# EAGLE design BiodataModular_007 (EAGLE 9.6.2)
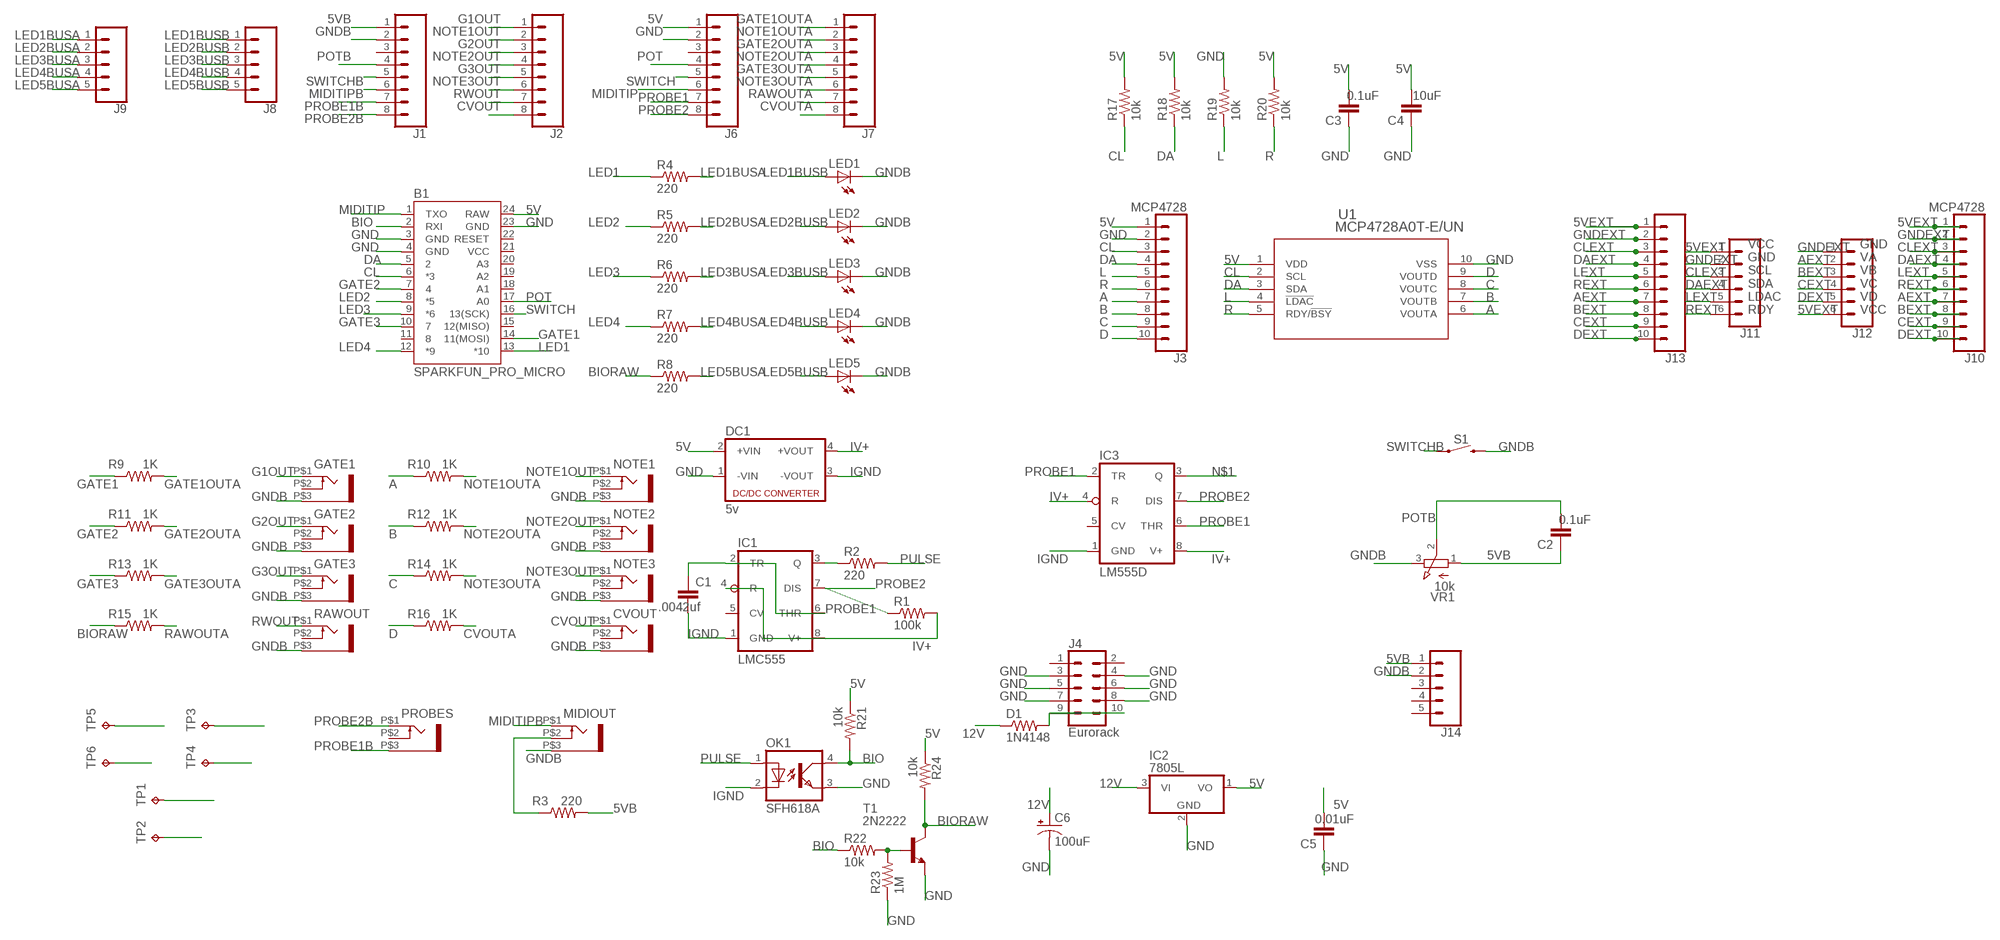
[diagram p0: schematic, sheet 1]

## Parts
B1  SPARKFUN_PRO_MICRO  [SPARKFUN_PRO_MICRO]
C1  .0042uf  C2.5/2  [C2.5-2]
C2  0.1uF  C2.5/2  [C2.5-2]
C3  0.1uF  C2.5/2  [C2.5-2]
C4  10uF  C2.5/2  [C2.5-2]
C5  0.01uF  C2.5/2  [C2.5-2]
C6  100uF  CPOL-USB45181A  [B45181A]
CVOUT  WQP-PJ301M-12_JACK  [WQP-PJ301M-12_JACK]
D1  1N4148  R-US_0204/2V  [0204V]
DC1  5v  NME  [NME]
GATE1  WQP-PJ301M-12_JACK  [WQP-PJ301M-12_JACK]
GATE2  WQP-PJ301M-12_JACK  [WQP-PJ301M-12_JACK]
GATE3  WQP-PJ301M-12_JACK  [WQP-PJ301M-12_JACK]
IC1  LMC555  LM555N  [DIL08]
IC2  7805L  [TO92]
IC3  LM555D  [SO08]
J1  CONN_08"  [1X08]
J2  CONN_08"  [1X08]
J3  MCP4728  CONN_10"  [1X10]
J4  Eurorack  CONN_05X2PTH  [2X5]
J6  CONN_08"  [1X08]
J7  CONN_08"  [1X08]
J8  CONN_05  [1X05]
J9  CONN_05  [1X05]
J10  MCP4728  CONN_10"  [1X10]
J11  CONN_06SILK_FEMALE_PTH  [1X06]
J12  CONN_06SILK_FEMALE_PTH  [1X06]
J13  CONN_10SMD_MALE  [1X10_SMD_MALE]
J14  CONN_05  [1X05]
LED1  LED3MM  [LED3MM]
LED2  LED3MM  [LED3MM]
LED3  LED3MM  [LED3MM]
LED4  LED3MM  [LED3MM]
LED5  LED3MM  [LED3MM]
MIDIOUT  WQP-PJ301M-12_JACK  [WQP-PJ301M-12_JACK]
NOTE1  WQP-PJ301M-12_JACK  [WQP-PJ301M-12_JACK]
NOTE2  WQP-PJ301M-12_JACK  [WQP-PJ301M-12_JACK]
NOTE3  WQP-PJ301M-12_JACK  [WQP-PJ301M-12_JACK]
OK1  SFH618A  SFH618A-5  [DIP4]
PROBES  WQP-PJ301M-12_JACK  [WQP-PJ301M-12_JACK]
R1  100k  R-US_0204/2V  [0204V]
R2  220  R-US_0204/2V  [0204V]
R3  220  R-US_0204/2V  [0204V]
R4  220  R-US_0204/2V  [0204V]
R5  220  R-US_0204/2V  [0204V]
R6  220  R-US_0204/2V  [0204V]
R7  220  R-US_0204/2V  [0204V]
R8  220  R-US_0204/2V  [0204V]
R9  1K  R-US_0204/2V  [0204V]
R10  1K  R-US_0204/2V  [0204V]
R11  1K  R-US_0204/2V  [0204V]
R12  1K  R-US_0204/2V  [0204V]
R13  1K  R-US_0204/2V  [0204V]
R14  1K  R-US_0204/2V  [0204V]
R15  1K  R-US_0204/2V  [0204V]
R16  1K  R-US_0204/2V  [0204V]
R17  10k  R-US_0204/2V  [0204V]
R18  10k  R-US_0204/2V  [0204V]
R19  10k  R-US_0204/2V  [0204V]
R20  10k  R-US_0204/2V  [0204V]
R21  10k  R-US_0204/2V  [0204V]
R22  10k  R-US_0204/2V  [0204V]
R23  1M  R-US_0204/2V  [0204V]
R24  10k  R-US_0204/2V  [0204V]
RAWOUT  WQP-PJ301M-12_JACK  [WQP-PJ301M-12_JACK]
S1  MOMENTARY-SWITCH-SPST-PTH-6.0MM  [TACTILE_SWITCH_PTH_6.0MM]
T1  2N2222  [TO92-EBC-OVAL]
TP1  TPB1,27  [B1,27]
TP2  TPB1,27  [B1,27]
TP3  TPB1,27  [B1,27]
TP4  TPB1,27  [B1,27]
TP5  TPB1,27  [B1,27]
TP6  TPB1,27  [B1,27]
U1  MCP4728A0T-E/UN  [MSOP10_MC]
VR1  10k  EVUF2A  [EVUF]

## Nets
5V: B1.24(RAW) C3.2 C4.2 C5.2 DC1.2(+VIN) IC2.1(VO) J3.1 J6.1 R17.2 R18.2 R20.2 R21.1 R24.1 U1.1(VDD)
5VB: C2.1 J1.1 J14.1 R3.2 VR1.1(A)
5VEXT: J10.1 J11.1 J12.6 J13.1
12V: C6.+ D1.1 IC2.3(VI)
A: J3.7 R10.1 U1.6(VOUTA)
AEXT: J10.7 J12.2 J13.7
B: J3.8 R12.1 U1.7(VOUTB)
BEXT: J10.8 J12.3 J13.8
BIO: B1.2(RXI) OK1.4(COL) R21.2 R22.1
BIORAW: R8.1 R15.1 R24.2 T1.C
C: J3.9 R14.1 U1.8(VOUTC)
CEXT: J10.9 J12.4 J13.9
CL: B1.6(*3) J3.3 R17.1 U1.2(SCL)
CLEXT: J10.3 J11.3 J13.3
CVOUT: CVOUT.P$1 J2.8
CVOUTA: J7.8 R16.2
D: J3.10 R16.1 U1.9(VOUTD)
DA: B1.5 J3.4 R18.1 U1.3(SDA)
DAEXT: J10.4 J11.4 J13.4
DEXT: J10.10 J12.5 J13.10
G1OUT: GATE1.P$1 J2.1
G2OUT: GATE2.P$1 J2.3
G3OUT: GATE3.P$1 J2.5
GATE1: B1.14(11(MOSI)) R9.1
GATE1OUTA: J7.1 R9.2
GATE2: B1.7 R11.1
GATE2OUTA: J7.3 R11.2
GATE3: B1.10 R13.1
GATE3OUTA: J7.5 R13.2
GND: B1.3(GND) B1.4(GND) B1.23(GND) C3.1 C4.1 C5.1 C6.- DC1.1(-VIN) IC2.2(GND) J3.2 J4.3 J4.4 J4.5 J4.6 J4.7 J4.8 J6.2 OK1.3(EMIT) R19.2 R23.1 T1.E U1.10(VSS)
GNDB: CVOUT.P$3 GATE1.P$3 GATE2.P$3 GATE3.P$3 J1.2 J14.2 LED1.K(C) LED2.K(C) LED3.K(C) LED4.K(C) LED5.K(C) MIDIOUT.P$3 NOTE1.P$3 NOTE2.P$3 NOTE3.P$3 RAWOUT.P$3 S1.3 VR1.3(E)
GNDEXT: J10.2 J11.2 J12.1 J13.2
IGND: C1.2 DC1.3(-VOUT) IC1.1(GND) IC3.1(GND) OK1.2(C)
IV+: DC1.4(+VOUT) IC1.4(R) IC1.8(V+) IC3.4(R) IC3.8(V+) R1.2
L: J3.5 R19.1 U1.4(!LDAC)
LED1: B1.13(*10) R4.1
LED1BUSA: J9.1 R4.2
LED1BUSB: J8.1 LED1.A
LED2: B1.8(*5) R5.1
LED2BUSA: J9.2 R5.2
LED2BUSB: J8.2 LED2.A
LED3: B1.9(*6) R6.1
LED3BUSA: J9.3 R6.2
LED3BUSB: J8.3 LED3.A
LED4: B1.12(*9) R7.1
LED4BUSA: J9.4 R7.2
LED4BUSB: J8.4 LED4.A
LED5BUSA: J9.5 R8.2
LED5BUSB: J8.5 LED5.A
LEXT: J10.5 J11.5 J13.5
MIDITIP: B1.1(TXO) J6.6
MIDITIPB: J1.6 MIDIOUT.P$1
N$1: IC1.3(Q) IC3.3(Q) R2.1
N$2: MIDIOUT.P$2 R3.1
N$7: D1.2 J4.9 J4.10
N$8: R22.2 R23.2 T1.B
NOTE1OUT: J2.2 NOTE1.P$1
NOTE1OUTA: J7.2 R10.2
NOTE2OUT: J2.4 NOTE2.P$1
NOTE2OUTA: J7.4 R12.2
NOTE3OUT: J2.6 NOTE3.P$1
NOTE3OUTA: J7.6 R14.2
POT: B1.17(A0) J6.4
POTB: C2.2 J1.4 VR1.2(S)
PROBE1: C1.1 IC1.2(TR) IC1.6(THR) IC3.2(TR) IC3.6(THR) J6.7
PROBE1B: J1.7 PROBES.P$3 TP2.TP
PROBE1C: TP4.TP
PROBE1C1: TP6.TP
PROBE2: IC1.7(DIS) IC3.7(DIS) J6.8 R1.1
PROBE2B: J1.8 PROBES.P$1 TP1.TP
PROBE2C: TP3.TP
PROBE2C1: TP5.TP
PULSE: OK1.1(A) R2.2
R: J3.6 R20.1 U1.5(RDY/!BSY)
RAWOUTA: J7.7 R15.2
REXT: J10.6 J11.6 J13.6
RWOUT: J2.7 RAWOUT.P$1
SWITCH: B1.16(13(SCK)) J6.5
SWITCHB: J1.5 S1.1
Unconnected: B1.11 B1.15(12(MISO)) B1.18(A1) B1.19(A2) B1.20(A3) B1.22(RESET) CVOUT.P$2 GATE1.P$2 GATE2.P$2 GATE3.P$2 IC1.5(CV) IC3.5(CV) J1.3 J4.1 J4.2 J6.3 J14.3 J14.4 J14.5 NOTE1.P$2 NOTE2.P$2 NOTE3.P$2 PROBES.P$2 RAWOUT.P$2

## Notes on the sheet
- VCC
  GND
  SCL
  SDA
  LDAC
  RDY
- GND
  VA
  VB
  VC
  VD
  VCC

## Power pins joined to a net without a drawn wire
VCC: B1.21(VCC)

## Library data of the parts
B1 = SparkFun-Boards:SPARKFUN_PRO_MICRO: SparkFun Pro Micro Atmega32U4 compatible footprint. SparkFun Products: 3.3V/8MHz <https://www.sparkfun.com/products/12587> 5V/16MHz <https://www.sparkfun.com/products/12640>
C1-C5 = capacitor-wima:C: CAPACITOR naming: grid - package width
C6 = adafruit:CPOL-US: POLARIZED CAPACITOR, American symbol
CVOUT GATE1-GATE3 MIDIOUT NOTE1-NOTE3 PROBES RAWOUT = thonkiconn:WQP-PJ301M-12_JACK
D1 R1-R24 = rcl:R-US_: RESISTOR, American symbol
DC1 = dc-dc-converter:NME: DC-DC CONVERTER; MF: C & D TECHNOLOGIES, INC; MPN: NME1205D; OC_FARNELL: 1021466; OC_NEWARK: 98B8198
IC1 = linear:*555: TIMER Changed DIP package to have round (not oval) pin pads http://www.ladyada.net/library/pcb/eaglelibrary.html
IC2 = adafruit:78*: Positive VOLTAGE REGULATOR Added bigger pads to the TO-92 package
IC3 = adafruit:*555: TIMER Changed DIP package to have round (not oval) pin pads http://www.ladyada.net/library/pcb/eaglelibrary.html
J1 J2 J6 J7 = SparkFun-Connectors:CONN_08: Multi connection point. Often used as Generic Header-pin footprint for 0.1 inch spaced/style header connections On any of the 0.1 inch spaced packages, you can populate with these: Break Away Headers - Straight <https://www.sparkfun.com/products/116> (PRT-00116) Break Away Male Headers - Right Angle <https://www.sparkfun.com/products/553> (PRT-00553) Female Headers <https://www.sparkfun.com/products/115> (PRT-00115) Break Away Headers - Machine Pin <https://www.sparkfun.com/products/117> (PRT-00117) Break Away Female Headers - Swiss Machine Pin <https://www.sparkfun.com/products/743> (PRT-00743) Arduino Stackable Header - 8 Pin <https://www.sparkfun.com/products/9279> (PRT-09279) For SCREWTERMINALS and SPRING TERMINALS visit here: Screw Terimnals on SparkFun.com <https://www.sparkfun.com/search/results?term=Screw+Terminals> (5mm/3.5mm/2.54mm spacing) This device is also useful as a general connection point to wire up your design to another part of your project. Our various solder wires solder well into these plated through hole pads. Hook-Up Wire - Assortment (Stranded, 22 AWG) <https://www.sparkfun.com/products/11375> (PRT-11375) Hook-Up Wire - Assortment (Solid Core, 22 AWG) <https://www.sparkfun.com/products/11367> (PRT-11367) View the entire wire category on our website here <https://www.sparkfun.com/categories/141> Special notes: Molex polarized connector foot print use with SKU : PRT-08231 with associated crimp pins and housings. 1MM SMD Version SKU: PRT-10208 NOTES ON THE VARIANTS LOCK and LOCK_LONGPADS... This footprint was designed to help hold the alignment of a through-hole component (i.e. 6-pin header) while soldering it into place. You may notice that each hole has been shifted either up or down by 0.005 of an inch from it's more standard position (which is a perfectly straight line). This slight alteration caused the pins (the squares in the middle) to touch the edges of the holes. Because they are alternating, it causes a "brace" to hold the component in place. 0.005 has proven to be the perfect amount of "off-center" position when using our standard breakaway headers. Although looks a little odd when you look at the bare footprint, once you have a header in there, the alteration is very hard to notice. Also,if you push a header all the way into place, it is covered up entirely on the bottom side.; PROD_ID: CONN-08438
J3 J10 = SparkFun-Connectors:CONN_10: Multi connection point. Often used as Generic Header-pin footprint for 0.1 inch spaced/style header connections On any of the 0.1 inch spaced packages, you can populate with these: Break Away Headers - Straight <https://www.sparkfun.com/products/116> (PRT-00116) Break Away Male Headers - Right Angle <https://www.sparkfun.com/products/553> (PRT-00553) Female Headers <https://www.sparkfun.com/products/115> (PRT-00115) Break Away Headers - Machine Pin <https://www.sparkfun.com/products/117> (PRT-00117) Break Away Female Headers - Swiss Machine Pin <https://www.sparkfun.com/products/743> (PRT-00743) Arduino Stackable Header - 10 Pin <https://www.sparkfun.com/products/11376> (PRT-11376) For SCREWTERMINALS and SPRING TERMINALS visit here: Screw Terimnals on SparkFun.com <https://www.sparkfun.com/search/results?term=Screw+Terminals> (5mm/3.5mm/2.54mm spacing) This device is also useful as a general connection point to wire up your design to another part of your project. Our various solder wires solder well into these plated through hole pads. Hook-Up Wire - Assortment (Stranded, 22 AWG) <https://www.sparkfun.com/products/11375> (PRT-11375) Hook-Up Wire - Assortment (Solid Core, 22 AWG) <https://www.sparkfun.com/products/11367> (PRT-11367) View the entire wire category on our website here <https://www.sparkfun.com/categories/141> Special notes: Molex polarized connector foot print use with SKU : PRT-08231 with associated crimp pins and housings. 1MM SMD Version SKU: PRT-10208 NOTES ON THE VARIANTS LOCK and LOCK_LONGPADS... This footprint was designed to help hold the alignment of a through-hole component (i.e. 6-pin header) while soldering it into place. You may notice that each hole has been shifted either up or down by 0.005 of an inch from it's more standard position (which is a perfectly straight line). This slight alteration caused the pins (the squares in the middle) to touch the edges of the holes. Because they are alternating, it causes a "brace" to hold the component in place. 0.005 has proven to be the perfect amount of "off-center" position when using our standard breakaway headers. Although looks a little odd when you look at the bare footprint, once you have a header in there, the alteration is very hard to notice. Also,if you push a header all the way into place, it is covered up entirely on the bottom side.; PROD_ID: CONN-11563
J4 = SparkFun-Connectors:CONN_05X2: Multi connection point. Often used as Generic Header-pin footprint for 0.1 inch spaced/style header connections For AVR SPI programming port, see special device with nice symbol: "AVR_SPI_PROG_5x2.dev" You can populate with any combo of single row headers, but if you'd like an exact match, check these: 2x5 AVR ICSP Male Header <https://www.sparkfun.com/products/778> (PRT-00778) 2x5 Pin Shrouded Header <https://www.sparkfun.com/products/8506> (PRT-08506) On any of the 0.1 inch spaced packages, you can populate with these: Break Away Headers - Straight <https://www.sparkfun.com/products/116> (PRT-00116) Break Away Male Headers - Right Angle <https://www.sparkfun.com/products/553> (PRT-00553) Female Headers <https://www.sparkfun.com/products/115> (PRT-00115) Break Away Headers - Machine Pin <https://www.sparkfun.com/products/117> (PRT-00117) Break Away Female Headers - Swiss Machine Pin <https://www.sparkfun.com/products/743> (PRT-00743) Special note: the shrouded connector mates well with our 5x2 ribbon cables: 2x5 Pin IDC Ribbon Cable <https://www.sparkfun.com/products/8535> (PRT-08535); PROD_ID: CONN-08499; SF_ID: PRT-0778
J8 J9 J14 = SparkFun-Connectors:CONN_05: Multi connection point. Often used as Generic Header-pin footprint for 0.1 inch spaced/style header connections On any of the 0.1 inch spaced packages, you can populate with these: Break Away Headers - Straight <https://www.sparkfun.com/products/116> (PRT-00116) Break Away Male Headers - Right Angle <https://www.sparkfun.com/products/553> (PRT-00553) Female Headers <https://www.sparkfun.com/products/115> (PRT-00115) Break Away Headers - Machine Pin <https://www.sparkfun.com/products/117> (PRT-00117) Break Away Female Headers - Swiss Machine Pin <https://www.sparkfun.com/products/743> (PRT-00743) For SCREWTERMINALS and SPRING TERMINALS visit here: Screw Terimnals on SparkFun.com <https://www.sparkfun.com/search/results?term=Screw+Terminals> (5mm/3.5mm/2.54mm spacing) This device is also useful as a general connection point to wire up your design to another part of your project. Our various solder wires solder well into these plated through hole pads. Hook-Up Wire - Assortment (Stranded, 22 AWG) <https://www.sparkfun.com/products/11375> (PRT-11375) Hook-Up Wire - Assortment (Solid Core, 22 AWG) <https://www.sparkfun.com/products/11367> (PRT-11367) View the entire wire category on our website here <https://www.sparkfun.com/categories/141> Special notes: Molex polarized connector foot print use with SKU : PRT-08231 with associated crimp pins and housings. 1MM SMD Version SKU: PRT-10208
J11 J12 = SparkFun-Connectors:CONN_06: Multi connection point. Often used as Generic Header-pin footprint for 0.1 inch spaced/style header connections On any of the 0.1 inch spaced packages, you can populate with these: Break Away Headers - Straight <https://www.sparkfun.com/products/116> (PRT-00116) Break Away Male Headers - Right Angle <https://www.sparkfun.com/products/553> (PRT-00553) Female Headers <https://www.sparkfun.com/products/115> (PRT-00115) Break Away Headers - Machine Pin <https://www.sparkfun.com/products/117> (PRT-00117) Break Away Female Headers - Swiss Machine Pin <https://www.sparkfun.com/products/743> (PRT-00743) Arduino Stackable Header - 6 Pin <https://www.sparkfun.com/products/9280> (PRT-09280) For SCREWTERMINALS and SPRING TERMINALS visit here: Screw Terimnals on SparkFun.com <https://www.sparkfun.com/search/results?term=Screw+Terminals> (5mm/3.5mm/2.54mm spacing) This device is also useful as a general connection point to wire up your design to another part of your project. Our various solder wires solder well into these plated through hole pads. Hook-Up Wire - Assortment (Stranded, 22 AWG) <https://www.sparkfun.com/products/11375> (PRT-11375) Hook-Up Wire - Assortment (Solid Core, 22 AWG) <https://www.sparkfun.com/products/11367> (PRT-11367) View the entire wire category on our website here <https://www.sparkfun.com/categories/141>; PROD_ID: CONN-08437
J13 = SparkFun-Connectors:CONN_10: Multi connection point. Often used as Generic Header-pin footprint for 0.1 inch spaced/style header connections On any of the 0.1 inch spaced packages, you can populate with these: Break Away Headers - Straight <https://www.sparkfun.com/products/116> (PRT-00116) Break Away Male Headers - Right Angle <https://www.sparkfun.com/products/553> (PRT-00553) Female Headers <https://www.sparkfun.com/products/115> (PRT-00115) Break Away Headers - Machine Pin <https://www.sparkfun.com/products/117> (PRT-00117) Break Away Female Headers - Swiss Machine Pin <https://www.sparkfun.com/products/743> (PRT-00743) Arduino Stackable Header - 10 Pin <https://www.sparkfun.com/products/11376> (PRT-11376) For SCREWTERMINALS and SPRING TERMINALS visit here: Screw Terimnals on SparkFun.com <https://www.sparkfun.com/search/results?term=Screw+Terminals> (5mm/3.5mm/2.54mm spacing) This device is also useful as a general connection point to wire up your design to another part of your project. Our various solder wires solder well into these plated through hole pads. Hook-Up Wire - Assortment (Stranded, 22 AWG) <https://www.sparkfun.com/products/11375> (PRT-11375) Hook-Up Wire - Assortment (Solid Core, 22 AWG) <https://www.sparkfun.com/products/11367> (PRT-11367) View the entire wire category on our website here <https://www.sparkfun.com/categories/141> Special notes: Molex polarized connector foot print use with SKU : PRT-08231 with associated crimp pins and housings. 1MM SMD Version SKU: PRT-10208 NOTES ON THE VARIANTS LOCK and LOCK_LONGPADS... This footprint was designed to help hold the alignment of a through-hole component (i.e. 6-pin header) while soldering it into place. You may notice that each hole has been shifted either up or down by 0.005 of an inch from it's more standard position (which is a perfectly straight line). This slight alteration caused the pins (the squares in the middle) to touch the edges of the holes. Because they are alternating, it causes a "brace" to hold the component in place. 0.005 has proven to be the perfect amount of "off-center" position when using our standard breakaway headers. Although looks a little odd when you look at the bare footprint, once you have a header in there, the alteration is very hard to notice. Also,if you push a header all the way into place, it is covered up entirely on the bottom side.; PROD_ID: CONN-11291
LED1-LED5 = adafruit:LED: LED OSRAM: - CHIPLED LG R971, LG N971, LY N971, LG Q971, LY Q971, LO R971, LY R971 LH N974, LH R974 LS Q976, LO Q976, LY Q976 LO Q996 - Hyper CHIPLED LW Q18S LB Q993, LB Q99A, LB R99A - SideLED LS A670, LO A670, LY A670, LG A670, LP A670 LB A673, LV A673, LT A673, LW A673 LH A674 LY A675 LS A676, LA A676, LO A676, LY A676, LW A676 LS A679, LY A679, LG A679 - Hyper Micro SIDELED® LS Y876, LA Y876, LO Y876, LY Y876 LT Y87S - SmartLED LW L88C, LW L88S LB L89C, LB L89S, LG L890 LS L89K, LO L89K, LY L89K LS L896, LA L896, LO L896, LY L896 - TOPLED LS T670, LO T670, LY T670, LG T670, LP T670 LSG T670, LSP T670, LSY T670, LOP T670, LYG T670 LG T671, LOG T671, LSG T671 LB T673, LV T673, LT T673, LW T673 LH T674 LS T676, LA T676, LO T676, LY T676, LB T676, LH T676, LSB T676, LW T676 LB T67C, LV T67C, LT T67C, LS T67K, LO T67K, LY T67K, LW E67C LS E67B, LA E67B, LO E67B, LY E67B, LB E67C, LV E67C, LT E67C LW T67C LS T679, LY T679, LG T679 LS T770, LO T770, LY T770, LG T770, LP T770 LB T773, LV T773, LT T773, LW T773 LH T774 LS E675, LA E675, LY E675, LS T675 LS T776, LA T776, LO T776, LY T776, LB T776 LHGB T686 LT T68C, LB T68C - Hyper Mini TOPLED® LB M676 - Mini TOPLED Santana® LG M470 LS M47K, LO M47K, LY M47K Source: http://www.osram.convergy.de/
OK1 = optocoupler:SFH618?*: Optocoupler, Phototransistor Output, Low Input Current Source: Data sheet <http://www.vishay.com/docs/83673/sfh618.pdf>; MF: VISHAY/TELEFUNKEN; MPN: SFH618A-5; OC_FARNELL: 1469593; OC_NEWARK: 59K0259
S1 = SparkFun-Switches:MOMENTARY-SWITCH-SPST: Momentary Switch (Pushbutton) - SPST Normally-open (NO) SPST momentary switches (buttons, pushbuttons). Variants PTH-12MM - 12mm square, through-hole Momentary Pushbutton Switch - 12mm Square <https://www.sparkfun.com/products/9190> (COM-09190) PTH-6.0MM, PTH-6.0MM-KIT - 6.0mm square, through-hole Mini Pushbutton Switch <https://www.sparkfun.com/products/97> (COM-00097) KIT package intended for soldering kit's - only one side of pads' copper is exposed. PTH-RIGHT-ANGLE-KIT - Right-angle, through-hole Right Angle Tactile Button <https://www.sparkfun.com/products/10791> - Used on SparkFun BigTime Watch Kit <https://www.sparkfun.com/products/11734> SMD-12MM - 12mm square, surface-mount Tactile Button - SMD (12mm) <https://www.sparkfun.com/products/12993> (COM-12993) Used on SparkFun PicoBoard <https://www.sparkfun.com/products/11888> SMD-4.5MM - 4.5mm Square Trackball Switch Used on SparkFun Blackberry Trackballer Breakout <https://www.sparkfun.com/products/13169> SMD-4.6MMX2.8MM - 4.60mm x 2.80mm, surface mount Used on SparkFun SAMD21 Mini Breakout <https://www.sparkfun.com/products/13664> SMD-5.2MM, SMD-5.2-REDUNDANT - 5.2mm square, surface-mount Mini Pushbutton Switch - SMD <https://www.sparkfun.com/products/8720> (COM-08720) Used on Arduino Pro Mini <https://www.sparkfun.com/products/11114> REDUNDANT package connects both switch circuits together SMD-6.0X3.5MM - 6.0 x 3.5mm, surface mount Momentary Reset Switch SMD <https://www.sparkfun.com/products/8229> (COM-08229) SMD-6.2MM-TALL - 6.2mm square, surface mount Tactile Button - SMD (6mm) <https://www.sparkfun.com/products/12992> Used on SparkFun Digital Sandbox <https://www.sparkfun.com/products/12651> SMD-RIGHT-ANGLE - Right-angle, surface mount Used on SparkFun Block for Intel® Edison - Arduino <https://www.sparkfun.com/products/13036>; PROD_ID: SWCH-08441; SF_SKU: COM-00097
T1 = adafruit:2N2222: NPN TRANSISTOR Big oval pads
TP1-TP6 = testpad:TP: Test pad
U1 = MCP4728:MCP4728A0T-E/UN; MANUFACTURER_PART_NUMBER: MCP4728A0TEUN; VENDOR: Microchip
VR1 = sam-pot:EVU: 9 mm Square Rotary Potentiometers Source: Panasonic

## Board
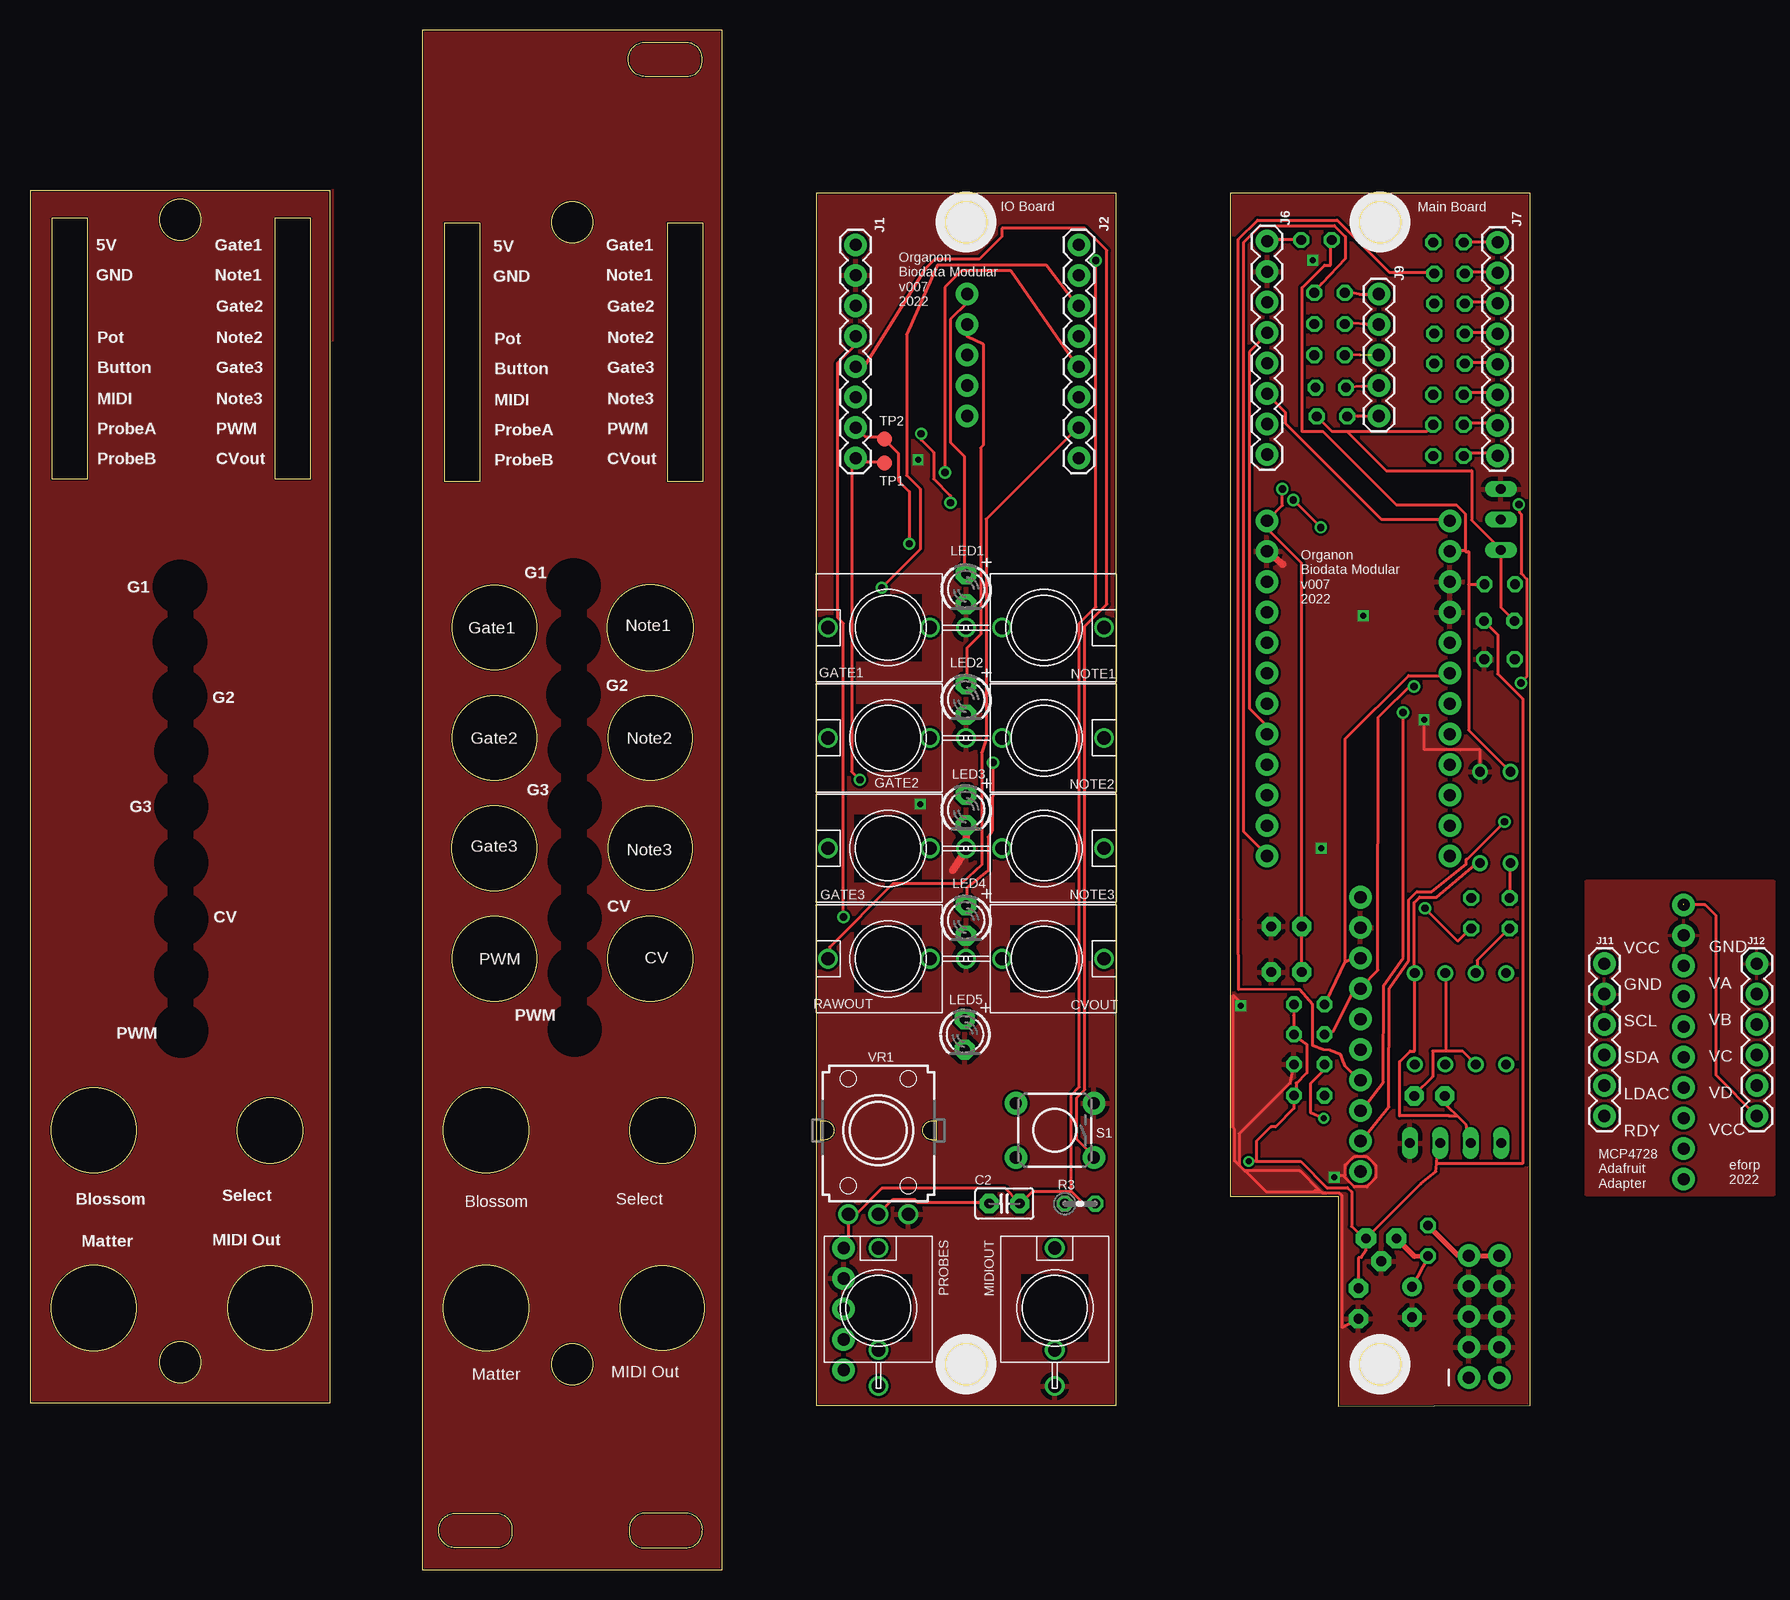
[diagram p1: board, top side]
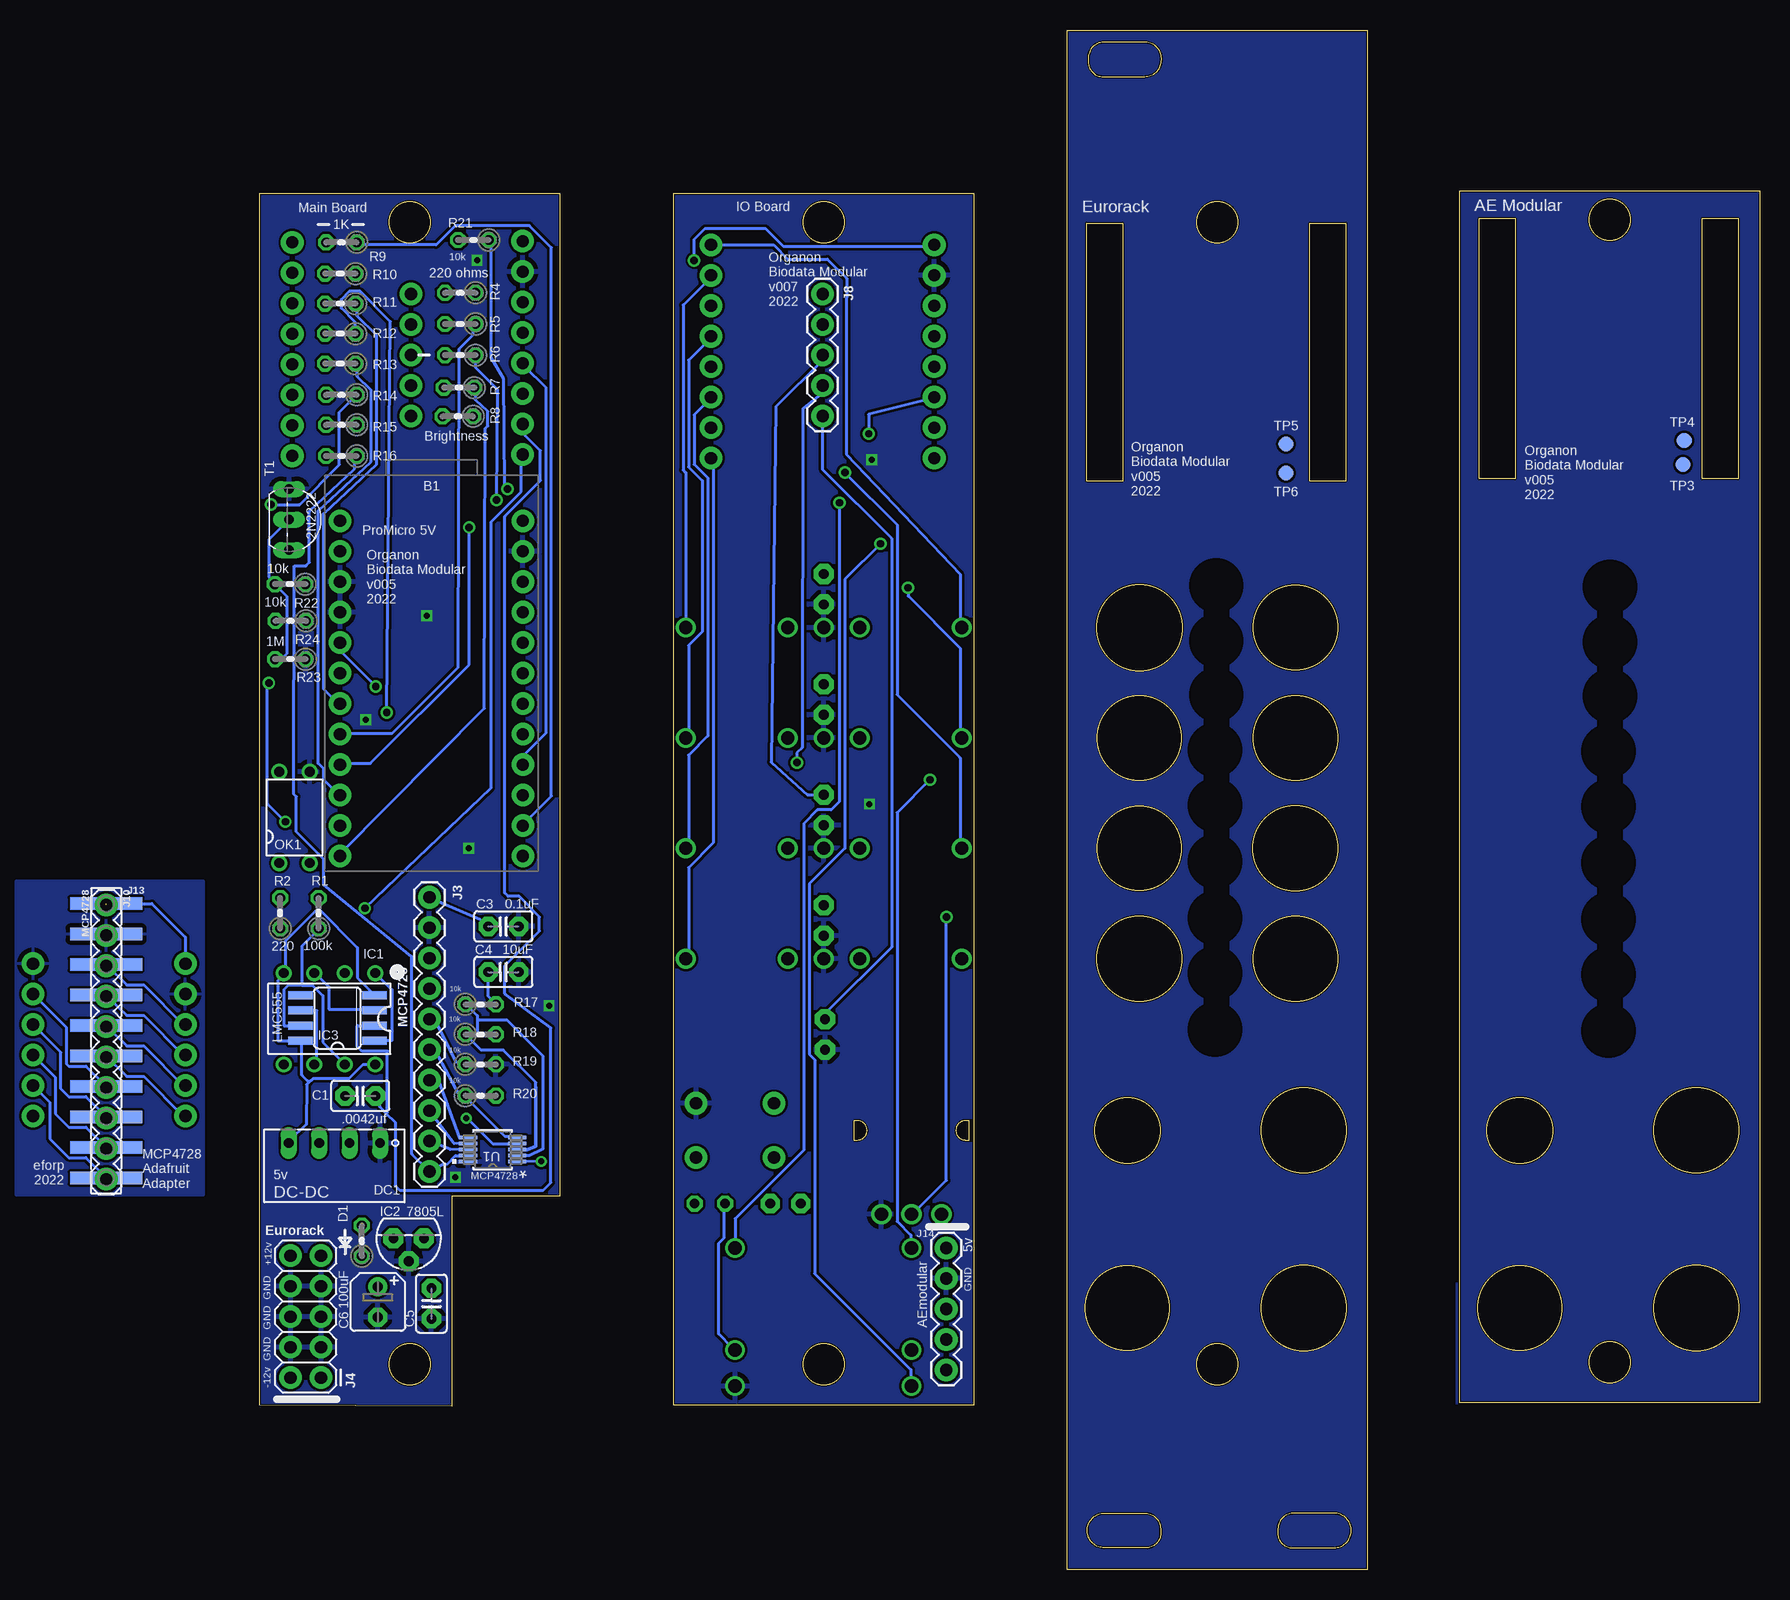
[diagram p2: board, bottom side, seen from below]

Size 125 x 128.3 mm. Coordinates in mm from the lower left corner, seen from the top.
Outline: 65.5,13.7 90.5,13.7 90.5,114.7 65.5,114.7 65.5,13.7
Outline: 125,13.7 125,114.7 100,114.7 100,31.1 109,31.1 109,13.6 125,13.7
Outline: 32.7,0 57.7,0 57.7,128.3 32.7,128.3 32.7,0
Outline: 0,13.9 25,13.9 25,114.9 0,114.9 0,13.9
Outline: 54.86,124.42 51.26,124.42 arc-90 49.86,125.82 arc-90 51.16,127.29 54.74,127.29 arc-90 55.96,125.9 55.96,125.72 arc-90 54.86,124.42
Outline: 39.06,1.82 35.46,1.82 arc-90 34.06,3.22 arc-90 35.36,4.69 38.94,4.69 arc-90 40.16,3.3 40.16,3.12 arc-90 39.06,1.82
Outline: 51.04,1.82 54.64,1.82 arc90 56.04,3.22 arc90 54.74,4.69 51.16,4.69 arc90 49.94,3.3 49.94,3.12 arc90 51.04,1.82
Outline: circle at 78,112.3 radius 1.7
Outline: circle at 78,17.1 radius 1.7
Outline: circle at 112.5,112.3 radius 1.7
Outline: circle at 112.5,17.1 radius 1.7
Outline: circle at 45.2,112.3 radius 1.7
Outline: circle at 45.2,17.1 radius 1.7
Outline: circle at 38.7,78.5 radius 3.52
Outline: circle at 51.7,78.5 radius 3.57
Outline: circle at 38.7,69.3 radius 3.51
Outline: circle at 51.7,69.3 radius 3.49
Outline: circle at 38.7,60.1 radius 3.54
Outline: circle at 51.7,60.1 radius 3.49
Outline: circle at 38.7,50.9 radius 3.52
Outline: circle at 51.7,50.9 radius 3.54
Outline: circle at 38,21.8 radius 3.54
Outline: circle at 52.7,21.8 radius 3.49
Outline: circle at 38,36.6 radius 3.54
Outline: circle at 52.7,36.6 radius 2.73
Outline: circle at 12.5,112.5 radius 1.7
Outline: circle at 12.5,17.3 radius 1.7
Copper layers (1*16): Top 0.035mm / dielectric 1.5mm / Bottom 0.035mm
Design rules "default *": minimum track width 10mil, minimum drill 24mil, track to track 8mil, track to pad 8mil, pad to pad 8mil, via to via 8mil, smd to smd 8mil, copper to edge 5mil, drill to drill 8mil, minimum pad ring 10mil, minimum via ring 8mil, stop-mask expansion 4mil, vias tented up to drill 0mil, thermal gap 15mil
tRestrict: area 12.1,81.5 to 12.9,82.3; area 12.1,72.4 to 12.9,73.2; area 12.1,76.9 to 12.9,77.7; area 12.2,63.2 to 13,64; area 12.2,67.8 to 13,68.6; area 12.2,53.8 to 13,54.6; area 12.2,58.5 to 13,59.3; area 12.2,44.5 to 13,45.3; area 12.2,49.2 to 13,50; area 44.9,81.6 to 45.7,82.4; area 44.9,72.5 to 45.7,73.3; area 44.9,77 to 45.7,77.8; 6 more areas; 2 lines
bRestrict: area 12.1,81.5 to 12.9,82.3; area 12.1,72.4 to 12.9,73.2; area 12.1,76.9 to 12.9,77.7; area 12.2,63.2 to 13,64; area 12.2,67.8 to 13,68.6; area 12.2,53.8 to 13,54.6; area 12.2,58.5 to 13,59.3; area 12.2,44.5 to 13,45.3; area 12.2,49.2 to 13,50; area 44.9,81.6 to 45.7,82.4; area 44.9,72.5 to 45.7,73.3; area 44.9,77 to 45.7,77.8; 6 more areas; 2 lines

### Footprints (pad centres in the part's own frame; a part is rotated, then mirrored left to right if it is on the bottom)
SPARKFUN_PRO_MICRO = drill 1.016 pad 1.88: 1 -7.62,12.7; 2 -7.62,10.16; 3 -7.62,7.62; 4 -7.62,5.08; 5 -7.62,2.54; 6 -7.62,0; 7 -7.62,-2.54; 8 -7.62,-5.08; 9 -7.62,-7.62; 10 -7.62,-10.16; 11 -7.62,-12.7; 12 -7.62,-15.24; 13 7.62,-15.24; 14 7.62,-12.7; 15 7.62,-10.16; 16 7.62,-7.62; 17 7.62,-5.08; 18 7.62,-2.54; 19 7.62,0; 20 7.62,2.54; 21 7.62,5.08; 22 7.62,7.62; 23 7.62,10.16; 24 7.62,12.7
C2.5-2 = drill 0.813 pad 1.6 octagon: 1 -1.27,0; 2 1.27,0
B45181A = drill 0.813 pad 1.6: + -1.27,0 | drill 0.813 pad 1.6 octagon: - 1.27,0
WQP-PJ301M-12_JACK = drill 1.1: P$1 0,5; P$2 0,-3.5; P$3 0,-6.5
0204V = drill 0.813 octagon: 1 -1.27,0; 2 1.27,0
NME = drill 0.813 long: 1 0,3.81; 2 0,1.27; 3 0,-1.27; 4 0,-3.81
DIL08 = drill 0.813 pad 1.27: 1 -3.81,-3.81; 2 -1.27,-3.81; 3 1.27,-3.81; 4 3.81,-3.81; 5 3.81,3.81; 6 1.27,3.81; 7 -1.27,3.81; 8 -3.81,3.81
TO92 = drill 0.813 pad 1.676 octagon: 1 -1.27,0; 2 0,1.905; 3 1.27,0
SO08 = smd 0.66 x 2.032: 1 -1.905,-3.073; 2 -0.635,-3.073; 3 0.635,-3.073; 4 1.905,-3.073; 5 1.905,3.073; 6 0.635,3.073; 7 -0.635,3.073; 8 -1.905,3.073
1X08 = drill 1.016 pad 1.88: 1 0,0; 2 2.54,0; 3 5.08,0; 4 7.62,0; 5 10.16,0; 6 12.7,0; 7 15.24,0; 8 17.78,0
1X10 = drill 1.016 pad 1.88: 1 0,0; 2 2.54,0; 3 5.08,0; 4 7.62,0; 5 10.16,0; 6 12.7,0; 7 15.24,0; 8 17.78,0; 9 20.32,0; 10 22.86,0
2X5 = drill 1.016 pad 1.88: 1 0,0; 2 0,2.54; 3 2.54,0; 4 2.54,2.54; 5 5.08,0; 6 5.08,2.54; 7 7.62,0; 8 7.62,2.54; 9 10.16,0; 10 10.16,2.54
1X05 = drill 1.016 pad 1.88: 1 0,0; 2 2.54,0; 3 5.08,0; 4 7.62,0; 5 10.16,0
1X06 = drill 1.016 pad 1.88: 1 0,0; 2 2.54,0; 3 5.08,0; 4 7.62,0; 5 10.16,0; 6 12.7,0
1X10_SMD_MALE = smd 1.02 x 6: 1 0,0; 2 2.54,0; 3 5.08,0; 4 7.62,0; 5 10.16,0; 6 12.7,0; 7 15.24,0; 8 17.78,0; 9 20.32,0; 10 22.86,0
LED3MM = drill 0.813 pad 1.676 octagon: A -1.27,0; K 1.27,0
DIP4 = drill 0.8: 1 -1.27,-3.81; 2 1.27,-3.81; 3 1.27,3.81; 4 -1.27,3.81
TACTILE_SWITCH_PTH_6.0MM = drill 1.016 pad 1.88: 1 -3.251,2.261; 2 3.251,2.261; 3 -3.251,-2.261; 4 3.251,-2.261
TO92-EBC-OVAL = drill 0.813 long: B 0,-1.27; C 2.54,-1.27; E -2.54,-1.27
B1,27 = smd 1.27 x 1.27: TP 0,0
MSOP10_MC = smd 1.524 x 0.279: 1 -2.045,1; 2 -2.045,0.5; 3 -2.045,0; 4 -2.045,-0.5; 5 -2.045,-1; 6 2.045,-1; 7 2.045,-0.5; 8 2.045,0; 9 2.045,0.5; 10 2.045,1
EVUF = drill 1.1 pad 1.676: 1 -2.5,-7; 2 0,-7; 3 2.5,-7

### Placement (x,y rotation side)
B1  110.7,74.7 0 bottom
C1  116.63,39.47 180 bottom
C2  81.2,30.5 180 top
C3  104.7,53.6 180 bottom
C4  104.7,49.8 180 bottom
C5  110.7,22.17 90 bottom
C6  115.17,22.3 270 bottom
CVOUT  84.5,50.9 270 top
D1  116.5,27.4 90 bottom
DC1  118.79,35.55 270 bottom
GATE1  71.5,78.5 90 top
GATE2  71.5,69.3 90 top
GATE3  71.5,60.1 90 top
IC1  119.2,45.9 180 bottom
IC2  112.6,27.6 180 bottom
IC3  118.53,45.96 90 bottom
J1  68.8,110.4 270 top
J2  87.4,110.4 270 top
J3  110.87,56.03 270 bottom
J4  119.9,16 90 bottom
J6  103.1,110.7 270 top
J7  122.3,110.6 270 top
J8  78.1,106.3 270 bottom
J9  112.4,106.3 270 top
J10  137.8,55.4 270 bottom  (outside the outline)
J11  131.2,50.5 270 top  (outside the outline)
J12  143.9,50.5 270 top  (outside the outline)
J13  137.8,55.5 270 bottom  (outside the outline)
J14  67.8,26.8 270 bottom
LED1  78,81.7 270 top
LED2  78,72.5 270 top
LED3  78,63.3 270 top
LED4  78,54.1 270 top
LED5  77.9,44.6 270 top
MIDIOUT  85.4,21.8 0 top
NOTE1  84.5,78.5 270 top
NOTE2  84.5,69.3 270 top
NOTE3  84.5,60.1 270 top
OK1  122.11,62.68 0 bottom
PROBES  70.7,21.8 0 top
R1  120.1,54.7 90 bottom
R2  123.3,54.7 90 bottom
R3  87.5,30.5 0 top
R4  108.3,106.4 180 bottom
R5  108.3,103.8 180 bottom
R6  108.3,101.2 180 bottom
R7  108.4,98.5 180 bottom
R8  108.5,96.1 180 bottom
R9  118.2,110.6 180 bottom
R10  118.3,108 180 bottom
R11  118.3,105.5 180 bottom
R12  118.3,103 180 bottom
R13  118.3,100.5 180 bottom
R14  118.2,97.9 180 bottom
R15  118.2,95.4 180 bottom
R16  118.2,92.8 180 bottom
R17  106.6,47.1 0 bottom
R18  106.6,44.6 0 bottom
R19  106.6,42.1 0 bottom
R20  106.6,39.5 0 bottom
R21  107.2,110.8 180 bottom
R22  122.48,82.12 180 bottom
R23  122.46,75.87 180 bottom
R24  122.43,79.06 180 bottom
RAWOUT  71.5,50.9 90 top
S1  85.4,36.6 180 top
T1  121.3,87.5 270 bottom
TP1  71.2,92.2 0 top
TP2  71.2,94.2 0 top
TP3  6.4,92.1 0 bottom
TP4  6.3,94.1 0 bottom
TP5  39.5,93.8 0 bottom
TP6  39.5,91.4 0 bottom
U1  105.6,35 180 bottom
VR1  70.7,36.6 0 top

### Tracks (layer width: path | path; a pad name or v marks a point on that pad's centre or on a via)
5V  (via drill 0.5, 0.61)
  Top 0.254: 117.22,33.83 117.16,33.17 115.9,32.14 111.66,27.89 IC2.1 111.33,27.4 | 117.22,33.83 117.26,34.45 117.46,34.64 DC1.2 | 111.33,27.4 110.13,28.6 110.13,31.47 109.77,31.83 108.07,31.83 105.89,34.01 102.2,34.01 | 111.33,27.4 111.33,26.58 110.95,26.01 110.7,25.98 C5.2 | R21.1 105.73,110.86 103.22,110.86 J6.1 | R17.2 105.31,46.48 105.31,46.19 R18.2 105.52,44.41 106.41,43.77 106.41,41.38 105.58,40.55 105.5,40.55 105.5,39.53 R20.2 105.33,38.43 103.8,36.9 103.4,36.9 102.2,35.7 102.2,34.01 | C4.2 105.96,49.82 105.96,53.48 C3.2 105.96,53.7 105.96,83.88 103.22,86.62 103.22,87.31 B1.24 103.22,87.54 104.36,88.68 v104.36,90.05 | 117.22,33.83 117.25,33.83 124.38,33.83 124.38,72.57 122.3,74.65 122.3,77.92 R24.1 | 101.4,34.01 v101.55,34.01 102.2,34.01
  Bottom 0.254: C4.2 105.96,49.59 105.96,47.76 105.5,47.3 R17.2 | J3.1 110.73,55.89 106.65,54.16 106.19,53.7 C3.2 | v104.36,90.05 104.59,90.28 104.69,99.23 105.73,100.97 105.73,110.63 R21.1 | v101.55,34.01 103.55,33.99 U1.1
5VB  (via drill 0.61)
  Top 0.254: 86.76,31.53 87.67,30.62 88.59,30.62 R3.2 | 86.76,31.53 83.56,31.53 82.64,30.62 C2.1 82.42,30.62 81.27,31.76 70.99,31.76 68.93,29.7 68.24,29.7 VR1.1 68.2,27.2 J14.1 | v88.82,109.1 88.82,80.22 87.45,78.85 87.45,40.22 86.76,39.53 86.76,31.53
  Bottom 0.254: v88.82,109.1 88.82,110.86 87.9,111.77 82.87,111.77 81.4,110.3 69.03,110.3 68.93,110.4 J1.1
5VEXT  (1 unrouted)
  Top 0.254: J12.6 140.5,41.2 140.5,54.5 140.05,54.95 139.6,55.4 J10.1
  Bottom 0.254: J11.1 131.2,52.7 134,55.5 J13.1
12V
  Top 0.254: D1.1 C6.+
  Top 0.406: D1.1 115.38,26.09 IC2.3
A
  Top 0.254: R10.1 116.86,108.11 113.28,108.11 108.93,112.45 102.31,112.45 100.7,110.86 100.7,54.16 100.72,48.35 105.82,48.33 106.88,47.08 106.89,43.67 107.79,43.34 108.31,43.29 109.23,42.89 109.59,41.95 110.73,40.8 J3.7
  Bottom 0.254: U1.6 108.37,35.98 110.12,40.77 J3.7
AEXT
  Bottom 0.254: J12.2 141.13,45.19 141.13,42.15 140.94,41.96 139.5,41.96 J13.7 J10.7
B  (via drill 0.61)
  Top 0.254: v114.42,71.42 114.42,51 112.82,48.69 112.79,40.62 110.96,38.29 J3.8
  Bottom 0.254: v114.42,71.42 114.12,104 116.63,106.51 117.55,106.51 118.23,105.83 118.23,105.14 117.09,104 117.09,103.08 R12.1 | U1.7 108.84,35.52 J3.8
BEXT
  Bottom 0.254: J10.8 J13.8 139.5,39.42 140.94,39.42 141.59,40.07 141.59,43.11 J12.3
BIO
  Top 0.254: 123.34,66.51 OK1.4 123.25,66.58 119.88,69.95 119.88,82.08 | 119.88,82.08 121.34,82.08 R22.1 | 119.62,84.95 119.62,87.95 118.88,88.7 113.88,88.7 107.75,94.83 106,94.83 106,106.83 107.88,108.7 108.38,108.7 108.38,110.8 R21.2 | 119.62,84.95 118.38,84.95 B1.2 | 119.88,82.08 119.88,84.83 119.62,84.83 119.62,84.95
BIORAW
  Top 0.254: 109.88,94.83 116.38,94.83 116.88,95.33 R15.1 | 109.88,94.83 108.5,94.83 107.25,96.08 R8.1 | 109.88,94.83 109.88,94.7 113,91.58 120.12,91.58 120.12,87.45 122.5,85.08 T1.C 122.57,80.19 R24.2
C  (via drill 0.61)
  Top 0.254: J3.9 110.96,35.77 113.25,38.56 113.28,48.47 114.88,50.78 114.88,55.8 115.56,56.49 116.81,56.49 119.68,58.76 119.68,59.19 119.75,59.2 v122.88,62.33 | v124.08,88.76 124.12,88.08 124.25,87.95 124.25,83.02 124.74,82.53 124.74,79.88 | v124.25,73.88 124.2,73.88 124.74,74.42 124.74,76.96 | 124.74,79.88 124.75,79.87 | 124.74,79.88 124.74,76.96 | 124.75,76.95 124.74,76.96
  Bottom 0.254: U1.8 109.14,35.01 J3.9 | v124.08,88.76 121.67,88.75 118.38,92.08 118.38,96.45 117,97.83 R14.1 | v124.25,73.88 124.38,73.75 124.38,63.83 v122.88,62.33
CEXT
  Bottom 0.254: J12.4 142.05,41.02 142.05,37.99 140.94,36.88 139.5,36.88 J13.9 137.7,35.08 J10.9
CL
  Top 0.254: 109.59,50.63 108.02,47.3 R17.1 | 109.59,50.63 109.94,50.81 110.73,50.86 J3.3 | 109.59,50.63 109.62,69.25 114.88,74.51 118.31,74.51 B1.6
  Bottom 0.254: 106.88,45.7 106.88,46.16 107.79,47.08 R17.1 | 106.88,45.7 106.88,44.56 | U1.2 103.45,34.5 102.53,34.5 101.41,35.03 101.41,42.8 104.4,45.8 106.78,45.8 106.88,45.7
CLEXT
  Bottom 0.254: J11.3 131.36,45.42 134.66,48.72 136.1,48.72 137.74,50.36 | 137.74,50.36 J13.3 J10.3 137.78,50.32 137.74,50.36
CVOUT
  Bottom 0.254: CVOUT.P$1 89.27,50.96 89.27,58.51 87.22,60.56 87.22,92.57 J2.8
CVOUTA
  Top 0.254: R16.2 119.61,93.02 122.19,93.02 J7.8
D
  Bottom 0.254: U1.9 107.79,34.5 108.7,34.5 109.35,33.81 109.76,33.77 110.73,33.26 J3.10 110.96,33.26 112.33,34.63 112.33,51.09 119.68,57.08 119.68,59.19 121.96,61.48 121.96,64.4 122.17,64.61 122.13,83.64 121.17,83.64 120.87,83.94 120.87,85.89 120.86,88.18 117.09,91.74 117.09,92.8 R16.1
DA  (via drill 0.61)
  Top 0.254: R18.1 108.02,44.79 108.57,44.83 110.37,48.39 J3.4 110.96,48.58 112.33,49.95 112.36,71.04 115.34,74.01 v115.34,73.59
  Bottom 0.254: v115.34,73.59 118.31,76.56 118.31,77.02 B1.5 | 102,40.2 102,40.6 104.7,43.3 106.57,43.3 R18.1
  Bottom 0.305: U1.3 102.7,35 102,35.3 102,40.2
DAEXT
  Bottom 0.254: J11.4 131.36,42.88 134.66,46.18 136.1,46.18 136.76,46.84 J13.4 J10.4
DEXT
  Bottom 0.254: J12.5 142.5,38.94 142.5,35.91 140.94,34.34 139.5,34.34 J13.10 J10.10
G1OUT
  Bottom 0.254: GATE1.P$1 66.64,78.62 66.64,82.97 76.13,92.95 76.13,104.34 76.1,107.6 77.7,109.2 81,109.2 82.19,110.39 82.19,110.4 87.22,110.4 J2.1
G2OUT  (via drill 0.61)
  Top 0.254: v70.99,81.82 74.19,85.02 74.19,90.05 73.04,91.2 73.04,102.94 75.59,108.68 84.7,108.68 87.22,105.37 J2.3
  Bottom 0.254: v70.99,81.82 70.99,81.14 66.64,76.79 66.64,69.48 GATE2.P$1
G3OUT  (via drill 0.61)
  Top 0.254: v76.24,91.42 76.24,106.85 77.62,108.23 81.73,108.23 87.22,100.34 J2.5
  Bottom 0.254: v76.24,91.42 71.9,87.08 71.9,72.91 66.64,67.65 66.64,60.11 GATE3.P$1
GATE1
  Bottom 0.254: R9.1 116.86,110.4 110.31,110.4 108.7,112 102.53,112 100.7,110.17 100.7,64.45 102.99,62.16 B1.14
GATE1OUTA
  Top 0.254: R9.2 119.61,110.63 122.19,110.63 J7.1
GATE2
  Bottom 0.254: R11.1 116.86,105.37 116.86,104.45 115.26,102.85 115.26,92.11 119.68,88 119.68,73.36 118.53,72.22 B1.7
GATE2OUTA
  Top 0.254: R11.2 119.61,105.6 122.19,105.6 J7.3
GATE3
  Bottom 0.254: R13.1 116.86,100.34 116.86,99.42 115.72,98.28 115.72,92.34 120.13,88.22 120.13,67.19 119.68,66.73 119.68,65.82 118.53,64.68 B1.10
GATE3OUTA
  Top 0.254: R13.2 119.61,100.57 122.19,100.57 J7.5
GND  (via drill 0.5)
  Top 0.254: OK1.3 120.84,68.3 119.2,68.3 119.2,68.33 116.17,68.33 v116.17,70.83 | v108.7,32.7 108.83,32.83 109.6,32.83 109.6,33.7 110.34,34.44 111.4,34.44 112.14,33.7 112.14,32.64 111.4,31.9 110.35,31.9 109.57,32.68 109.57,32.87 | R19.2 104.98,40.49 104.92,40.49 100.77,36.34 100.77,33.69 | 101.27,33.23 101.22,33.23 100.77,33.69 | 101.27,33.23 103,31.5 107.4,31.5 | 107.4,31.5 107.52,31.5 | 107.52,31.5 107.58,31.5 105.85,33.23 101.27,33.23 | 107.52,31.5 107.47,31.55 | 100.85,46.99 100.85,47.27 100.26,47.86 100.26,36.84 100.4,36.71 100.4,34.06 100.77,33.69 | 107.4,31.5 107.79,31.37 109.13,31.37 109.3,31.2 109.3,20.2 C5.1 | 107.1,31.6 107.4,31.5
  Top 0.61: B1.23 104.4,83.8
  Bottom 0.254: v116.17,70.83 116.17,71.02 116.06,71.02
  other vias: 107.6,60.1 106.9,109.1 100.9,47 111.1,79.5
  pour Top: 100,13.7 125,13.7 125,114.6 100.1,114.6 100.1,13.9
  pour Bottom: 125,13.6 125,114.7 100,114.7 100,13.6
GNDB  (via drill 0.5)
  Top 0.61: LED3.K 78,60 76.9,58.3
  other vias: 74.2,63.8 74,92.5
  pour Top: 90.7,13.6 90.7,114.7 65.5,114.7 65.5,13.7
  pour Bottom: 90.8,13.8 90.8,114.7 65.5,114.7 65.5,13.7
GNDEXT
  pour Bottom: 129.7,31.2 145.3,31.2 145.3,57.4 129.7,57.4
  pour Top: 129.7,31.2 129.7,57.4 145.3,57.4 145.3,31.2 129.8,31.2
IGND
  Top 0.254: 118.92,37.82 118.16,38.58 C1.2 | 118.92,37.82 119.68,37.06 120,35.61 DC1.3 | OK1.2 120.82,58.73 120.44,58.73 117.23,56.03 115.79,56.03 115.34,55.58 115.34,49.86 IC1.1 115.38,49.7 115.38,43.2 115,43.2 114.12,42.33 114.12,37.81 118.25,37.81 118.92,37.82
  Bottom 0.254: IC3.1 115.38,44.08 114,44.08 114,48.33 115.38,49.7 IC1.1
IV+
  Bottom 0.254: 120.15,55.1 120.13,55.12 120.13,55.8 R1.2 | 120.15,55.1 122.88,52.38 122.88,49.86 IC1.4 | 120.92,40.61 120.6,40.9 117.6,40.9 116.41,42.09 115.56,42.09 IC1.8 | 120.92,40.61 121.06,40.48 121.1,40.43 121.11,37.1 122.52,35.77 DC1.4 | 122.88,49.63 IC1.4 | 120.92,40.61 121,40.7 121.5,41.2 121.5,43.95 IC3.8 121.62,44.08 123.5,44.08 123.5,49.08 123,49.58 IC1.4 | 120.15,55.1 116.88,51.83 116.88,49.33 115.5,47.95 IC3.4
L  (via drill 0.5)
  Top 0.254: R19.1 107.87,41.67 106.7,40.5 106.7,38.1 v107.8,37.6
  Bottom 0.254: R19.1 108.02,42.27 108.67,42.3 110.47,45.86 J3.5 | v107.8,37.6 107.7,37.6 105.6,35.5 U1.4
LED1
  Top 0.254: R4.1 107.33,106.88 107.63,107.17 109.62,109.26 109.62,111.08 108.7,112 102.53,112 101.16,110.63 101.16,61.48 102.99,59.65 B1.13
LED1BUSA
  Top 0.254: R4.2 110.35,106.38 110.76,106.28 J9.1
LED1BUSB
  Top 0.254: LED1.A 77.84,83.19 77.84,92.8 76.7,93.94 76.7,104.18 78.1,105.58 J8.1
LED2
  Bottom 0.254: R5.1 107.23,103.74 107.23,102.9 108.38,101.75 108.48,75.19 113.96,69.71 118.31,69.71 B1.8
LED2BUSA
  Top 0.254: R5.2 110.25,103.87 111.36,103.77 J9.2
LED2BUSB
  Top 0.254: LED2.A 78.07,73.82 78.07,76.79 79.22,77.94 79.22,93.48 79.44,93.71 79.44,102.1 78.1,102.74 J8.2
LED3  (via drill 0.61)
  Top 0.254: v107.56,86.85 v105.28,89.14
  Bottom 0.254: v105.28,89.14 105.18,98.33 107,100.15 107,101 R6.1 | v107.56,86.85 107.56,75.42 115.79,67.19 118.31,67.19 B1.9
LED3BUSA  (1 unrouted)
  Top 0.254: 110.85,101.23 R6.2 | 111.76,101.23 J9.3
LED3BUSB
  Bottom 0.254: LED3.A 79.37,64.58 82.39,67.29 81.99,96.91 78.1,100.8 J8.3
LED4
  Bottom 0.254: R7.1 107,98.48 107,97.44 105.99,96.52 105.99,95.31 106.2,95.1 106.29,71.76 118.31,59.65 B1.12
LED4BUSA
  Top 0.254: R7.2 109.95,98.51 110.96,98.61 J9.4
LED4BUSB  (via drill 0.61)
  Top 0.254: v80.25,67.25 80.2,61.6 79.84,61.05 79.84,58.28 78.07,56.81 78.07,55.53 LED4.A
  Bottom 0.254: v80.25,67.25 80.25,68.05 79.8,68.5 79.75,96.74 78.2,97.98 78.2,98.58 J8.4
LED5BUSA
  Top 0.254: R8.2 110.68,96.1 111.26,96.1 J9.5
LED5BUSB
  Bottom 0.254: LED5.A 77.84,45.93 77.84,46.39 72.36,51.88 72.36,85.94 78.07,91.65 78.07,96.11 J8.5
LEXT
  Bottom 0.254: J11.5 131.36,40.34 134.66,43.64 136.1,43.64 J13.5 J10.5
MIDITIP
  Top 0.254: B1.1 118.31,87.54 112.59,87.54 104.59,95.54 104.59,96.45 103.22,97.83 J6.6
MIDITIPB  (via drill 0.61)
  Top 0.254: v74.26,94.65 74.26,94.14 75.3,93.1 75.3,90.9 76.7,89.5 v76.7,88.91
  Bottom 0.254: v76.7,88.91 76.7,63.99 77.39,63.31 78.53,63.31 79.67,62.16 79.67,34.96 85.39,29.24 85.39,26.96 MIDIOUT.P$1 | v74.26,94.65 74.26,96.27 68.93,97.6 J1.6
N$1
  Top 0.254: IC1.3 120.59,49.86 120.59,50.78 123.11,53.29 R2.1
  Bottom 0.254: IC3.3 115.5,46.7 119.25,46.7 119.25,48.58 120.38,49.7 IC1.3
N$2
  Bottom 0.254: R3.1 86.3,30.39 86.3,27.64 86.76,27.19 86.76,19.64 85.62,18.5 MIDIOUT.P$2
N$3
  pour Top: 0,13.7 25,13.9 25.2,115 0,115
N$4
  pour Top: 32.7,0 57.7,0 57.6,128.2 32.8,128.2
N$5
  pour Bottom: -0.1,13.84 25.2,13.84 25,114.8 0,115
N$6
  pour Bottom: 57.6,0 57.6,128.2 32.8,128.2 32.8,0
N$7
  Top 0.406: D1.2 119.01,26.16 J4.9 J4.10
N$8
  Bottom 0.254: T1.B 122.62,87.45 124.25,85.83 124.25,82.7 123.88,82.33 R22.2 122.74,81.11 122.74,76.34 123.21,75.87 R23.2
NOTE1OUT
  Bottom 0.254: NOTE1.P$1 89.5,78.62 89.5,91.42 89.73,91.65 89.73,105.37 87.45,107.66 J2.2
NOTE1OUTA
  Top 0.254: R10.2 119.61,108.11 122.19,108.11 J7.2
NOTE2OUT
  Bottom 0.254: NOTE2.P$1 89.27,69.48 89.27,77.02 88.13,78.17 88.13,90.74 89.27,91.88 89.27,100.8 87.45,102.62 J2.4
NOTE2OUTA
  Top 0.254: R12.2 119.61,103.08 122.19,103.08 J7.4
NOTE3OUT
  Bottom 0.254: NOTE3.P$1 89.27,60.11 89.27,67.88 87.67,69.48 87.67,90.97 88.82,92.11 88.82,96.23 87.45,97.6 J2.6
NOTE3OUTA
  Top 0.254: R14.2 119.61,98.05 122.19,98.05 J7.6
POT
  Top 0.254: B1.17 102.99,69.71 102.99,70.39 101.62,71.76 101.62,101.48 102.99,102.85 J6.4
POTB  (via drill 0.61)
  Top 0.254: C2.2 79.9,30.62 73.96,30.62 73.73,30.84 71.9,30.84 70.76,29.7 VR1.2 | v67.79,54.39 67.79,78.85 67.33,79.31 67.33,100.57 68.7,101.94 68.7,102.62 J1.4
  Bottom 0.254: v67.79,54.39 67.79,32.45 70.53,29.7 VR1.2
PROBE1
  Top 0.254: 118,43.2 118,49.7 IC1.2 | 118,43.2 119.38,43.2 120.38,42.2 IC1.6 | 118,43.2 116.88,43.2 116.88,41.08 115.37,39.56 C1.1
  Bottom 0.254: 114.45,38 114.96,38.52 C1.1 | 114.45,38 113.73,37.29 113.73,32 113.36,31.63 101.37,31.63 100.75,32.25 100.75,45.15 104.59,47.99 104.59,50.31 101.7,53.2 101.7,54.4 103.4,56.1 104.3,56.1 104.6,56.4 104.59,87.77 101.62,90.74 101.62,93.25 102.99,94.62 102.99,95.31 J6.7 | IC3.2 116.88,45.33 116.88,43.58 116.5,43.2 114.38,43.2 114.38,38.08 114.45,38 | IC3.6 121.5,46.58 120.25,46.58 120.25,42.33 120.38,42.2 IC1.6
PROBE1B  (via drill 0.61)
  Top 0.254: J1.7 68.93,95.08 69.61,94.4 70.99,94.4 TP2.TP 71.22,94.17 72.36,93.02 72.36,90.74 73.27,89.82 v73.27,85.48
  Bottom 0.254: v73.27,85.48 76.24,82.51 76.24,60.11 79.22,57.13 79.22,42.96 78.76,42.5 78.76,24.67 70.76,16.67 70.76,15.3 PROBES.P$3
PROBE2  (via drill 0.61)
  Top 0.254: R1.1 119.91,53.29 118.99,52.38 v116.25,55.12
  Bottom 0.254: v116.25,55.12 105.73,65.14 105.73,87.31 103.22,89.82 103.22,92.8 J6.8 | IC3.7 123,45.33 123,48.33 122.62,48.7 121.5,48.7 | 121.5,48.7 121.5,51.95 120.12,53.33 R1.1 | 121.5,48.7 120.62,48.7 119.75,47.83 119.75,43.95 118,42.2 IC1.7
PROBE2B  (via drill 0.61)
  Top 0.254: TP1.TP 70.99,92.34 69.16,92.34 68.93,92.57 J1.8 68.7,92.57 68.47,92.34 68.47,66.51 v69.16,65.82
  Bottom 0.254: v69.16,65.82 71.9,63.08 71.9,29.02 70.76,27.87 70.76,26.96 PROBES.P$1
PULSE
  Top 0.254: OK1.1 123.34,58.73 123.34,56.03 R2.2
R
  Bottom 0.254: U1.5 103.68,36.1 104.59,36.1 107.79,39.3 R20.1 108.34,39.48 110.37,43.27 110.73,43.32 J3.6
RAWOUTA
  Top 0.254: R15.2 119.61,95.54 122.19,95.54 J7.7
REXT
  Bottom 0.254: J11.6 131.36,37.8 134.66,41.1 136.1,41.1 J13.6 J10.6
RWOUT
  Top 0.254: RAWOUT.P$1 66.64,50.96 66.64,51.88 71.9,57.13 77.61,57.13 79.3,58.72 79.3,68.08 79.67,69.25 79.67,87.54 87.22,95.08 J2.7
SWITCH
  Bottom 0.254: B1.16 102.99,67.19 102.99,67.88 101.16,69.71 101.16,98.51 102.99,100.34 J6.5
SWITCHB
  Top 0.254: J1.5 68.93,100.34 69.56,100.34 74.6,108.4 75.4,109.2 79.1,109.2 80.99,111.09 80.99,111.77 87.9,111.77 89.73,109.94 89.73,80.45 87.9,78.62 87.9,39.99 87.22,39.3 87.22,35.87 88.59,34.5 S1.1

### Text on the board
tNames: IO Board | Main Board | 5V | Gate1 | 5V | Gate1 | GND | Note1 | GND | Note1 | Organon / Biodata Modular / v007 / 2022 | Gate2 | Gate2 | Pot | Note2 | Pot | Note2 | Button | Gate3 | Button | Gate3 | MIDI | Note3 | MIDI | Note3 | ProbeA | PWM | ProbeA | PWM | ProbeB | CVout | ProbeB | CVout | LED1 | G1 | G1 | Organon / Biodata Modular / v007 / 2022 | Gate1 | Note1 | G2 | G2 | Gate2 | Note2 | G3 | G3 | Gate3 | Note3 | CV | CV | PWM | CV | PWM | PWM | VCC / / GND / / SCL / / SDA / / LDAC / / RDY | GND / / VA / / VB / / VC / / VD / / VCC | MCP4728 / Adafruit / Adapter | eforp / 2022 | Blossom | Select | Select | Blossom | Matter | MIDI Out | Matter | MIDI Out
bNames: AE Modular | IO Board | Eurorack | Main Board | 1K | 220 ohms | Organon / Biodata Modular / v007 / 2022 | Brightness | Organon / Biodata Modular / v005 / 2022 | Organon / Biodata Modular / v005 / 2022 | ProMicro 5V | Organon / Biodata Modular / v005 / 2022 | 220 | 10k | 10k | 10k | 10k | eforp / 2022 | MCP4728 | MCP4728 / Adafruit / Adapter | 5v | +12v | AEmodular | GND | GND | GND | GND | -12v
tValues: 220
tStop: organon | organon | eforp | thom | eforp | thom
tKeepout: organon
tRestrict: organon